# Altium schematic sheet STM32.SchDoc
size A
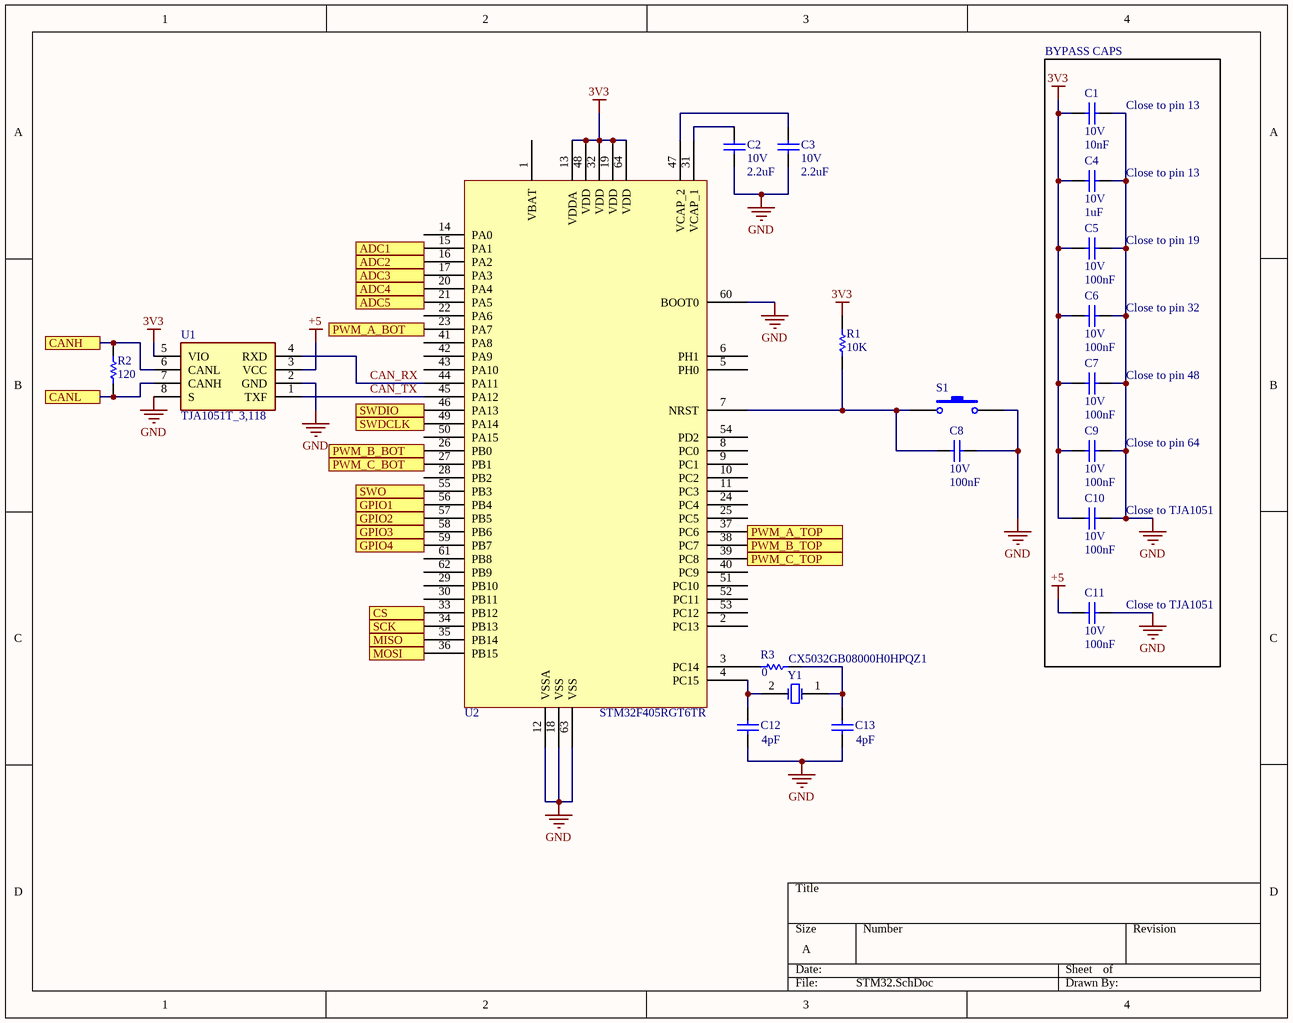
[diagram p0: STM32.SchDoc]

## Parts
C1  10V  value 10nF  [C0805]
C2  10V  value 2.2uF  [C0805]
C3  10V  value 2.2uF  [C0805]
C4  10V  value 1uF  [C0805]
C5  10V  value 100nF  [C0805]
C6  10V  value 100nF  [C0805]
C7  10V  value 100nF  [C0805]
C8  10V  value 100nF  [C0805]
C9  10V  value 100nF  [C0805]
C10  10V  value 100nF  [C0805]
C11  10V  value 100nF  [C0805]
C12  value 4pF  [C0805]  (hidden comment: 50V)
C13  value 4pF  [C0805]  (hidden comment: 50V)
R1  value 10K  [J1-0603]  (hidden comment: 5%)
R2  value 120  [J1-0603]  (hidden comment: 5%)
R3  value 0  [J1-0603]  (hidden comment: 0603)
S1  SW-PB  [PTS636 SM43 SMTR LFS]  (value not drawn)
U1  TJA1051T_3,118  [SOIC127P600X175-8N]
U2  STM32F405RGT6TR  [STM32F405RGT6TR]
Y1  CX5032GB08000H0HPQZ1  [CX5032GB08000H0HPQZ1]

## Ports
ADC1, ADC2, ADC3, ADC4, ADC5, CANH, CANL, CS, GPIO1, GPIO2, GPIO3, GPIO4, MISO, MOSI, PWM_A_BOT, PWM_A_TOP, PWM_B_BOT, PWM_B_TOP, PWM_C_BOT, PWM_C_TOP, SCK, SWDCLK, SWDIO, SWO

## Nets
3V3: C1.1 C4.2 C5.1 C6.1 C7.1 C9.1 C10.1 R1.2 U1.5(VIO) U2.13(VDDA) U2.19(VDD) U2.32(VDD) U2.48(VDD) U2.64(VDD)
+5: C11.1 U1.3(VCC)
GND: C1.2 C2.1 C3.1 C4.1 C5.2 C6.2 C7.2 C8.2 C9.2 C10.2 C11.2 C12.1 C13.1 S1.2 U1.2(GND) U1.8(S) U2.12(VSSA) U2.18(VSS) U2.60(BOOT0) U2.63(VSS)
ADC1: U2.15(PA1) ; port ADC1
ADC2: U2.16(PA2) ; port ADC2
ADC3: U2.17(PA3) ; port ADC3
ADC4: U2.20(PA4) ; port ADC4
ADC5: U2.21(PA5) ; port ADC5
CAN_RX: U1.4(RXD) U2.44(PA11)
CAN_TX: U1.1(TXF) U2.45(PA12)
CANH: R2.2 U1.6(CANL) ; port CANH
CANL: R2.1 U1.7(CANH) ; port CANL
CS: U2.33(PB12) ; port CS
GPIO1: U2.56(PB4) ; port GPIO1
GPIO2: U2.57(PB5) ; port GPIO2
GPIO3: U2.58(PB6) ; port GPIO3
GPIO4: U2.59(PB7) ; port GPIO4
MISO: U2.35(PB14) ; port MISO
MOSI: U2.36(PB15) ; port MOSI
PWM_A_BOT: U2.23(PA7) ; port PWM_A_BOT
PWM_A_TOP: U2.37(PC6) ; port PWM_A_TOP
PWM_B_BOT: U2.26(PB0) ; port PWM_B_BOT
PWM_B_TOP: U2.38(PC7) ; port PWM_B_TOP
PWM_C_BOT: U2.27(PB1) ; port PWM_C_BOT
PWM_C_TOP: U2.39(PC8) ; port PWM_C_TOP
SCK: U2.34(PB13) ; port SCK
SWDCLK: U2.49(PA14) ; port SWDCLK
SWDIO: U2.46(PA13) ; port SWDIO
SWO: U2.55(PB3) ; port SWO
NetC2_2: C2.2 U2.31(VCAP_1)
NetC3_2: C3.2 U2.47(VCAP_2)
NetC8_1: C8.1 R1.1 S1.1 U2.7(NRST)
NetC12_2: C12.2 U2.4(PC15) Y1.2(OSC2)
NetC13_2: C13.2 R3.2 Y1.1(OSC1)
NetR3_1: R3.1 U2.3(PC14)

Not connected (* = marked no-connect by the designer): U2 1(VBAT) 2(PC13) 5(PH0) 6(PH1) 8(PC0) 9(PC1) 10(PC2) 11(PC3) 14(PA0) 22(PA6) 24(PC4) 25(PC5) 28(PB2) 29(PB10) 30(PB11) 40(PC9) 41(PA8) 42(PA9) 43(PA10) 50(PA15) 51(PC10) 52(PC11) 53(PC12) 54(PD2) 61(PB8) 62(PB9)

## Notes on the sheet
- BYPASS CAPS
- (near C1) Close to pin 13
- (near C4) Close to pin 13
- (near C5) Close to pin 19
- (near C6) Close to pin 32
- (near C7) Close to pin 48
- (near C9) Close to pin 64
- (near C10) Close to TJA1051
- (near C11) Close to TJA1051

## Library data of the parts
C1 = Cap: C0805C103K8RAC7800. 10000pF ±10% 10V Ceramic Capacitor X7R 0805 (2012 Metric) /; Published: 8-Jun-2000; LatestRevisionDate: 17-Jul-2002; LatestRevisionNote: Re-released for DXP Platform.; PackageReference: RAD-0.3; Publisher: Altium Limited; PackageDescription: Radial Cap, Thru-Hole; 2 Leads; 0.3 in Pin Spacing
C2 C3 = Cap: C0805C225K8RACAUTO. 2.2µF ±10% 10V Ceramic Capacitor X7R 0805 (2012 Metric) /; Published: 8-Jun-2000; LatestRevisionDate: 17-Jul-2002; LatestRevisionNote: Re-released for DXP Platform.; PackageReference: RAD-0.3; Publisher: Altium Limited; PackageDescription: Radial Cap, Thru-Hole; 2 Leads; 0.3 in Pin Spacing
C4 = Cap: CL21B105KPFNNNE. 1µF ±10% 10V Ceramic Capacitor X7R 0805 (2012 Metric) /; Published: 8-Jun-2000; LatestRevisionDate: 17-Jul-2002; LatestRevisionNote: Re-released for DXP Platform.; PackageReference: RAD-0.3; Publisher: Altium Limited; PackageDescription: Radial Cap, Thru-Hole; 2 Leads; 0.3 in Pin Spacing
C5-C11 = Cap: C0805C104K8RACTU. 0.1µF ±10% 10V Ceramic Capacitor X7R 0805 (2012 Metric) /; Published: 8-Jun-2000; LatestRevisionDate: 17-Jul-2002; LatestRevisionNote: Re-released for DXP Platform.; PackageReference: RAD-0.3; Publisher: Altium Limited; PackageDescription: Radial Cap, Thru-Hole; 2 Leads; 0.3 in Pin Spacing
C12 = Cap: CBR08C409B5GAC. 4pF ±0.1pF 50V Ceramic Capacitor C0G, NP0 0805 (2012 Metric); Published: 8-Jun-2000; LatestRevisionDate: 17-Jul-2002; LatestRevisionNote: Re-released for DXP Platform.; PackageReference: RAD-0.3; Publisher: Altium Limited; PackageDescription: Radial Cap, Thru-Hole; 2 Leads; 0.3 in Pin Spacing
C13 = Cap: CBR08C409B5GAC; Published: 8-Jun-2000; LatestRevisionDate: 17-Jul-2002; LatestRevisionNote: Re-released for DXP Platform.; PackageReference: RAD-0.3; Publisher: Altium Limited; PackageDescription: Radial Cap, Thru-Hole; 2 Leads; 0.3 in Pin Spacing
R1 R2 = Res1: ERJ-3GEYJ103V. 10 kOhms ±5% 0.1W, 1/10W Chip Resistor 0603 (1608 Metric) Automotive AEC-Q200 Thick Film /; Published: 8-Jun-2000; LatestRevisionDate: 17-Jul-2002; LatestRevisionNote: Re-released for DXP Platform.; PackageReference: AXIAL-0.3; Publisher: Altium Limited; PackageDescription: Axial Device, Thru-Hole; 2 Leads; 0.3 in Pin Spacing
R3 = Res1: ERJ-U030R00V. 0 Ohms Jumper 0.1W, 1/10W Chip Resistor 0603 (1608 Metric) Anti-Sulfur, Automotive AEC-Q200 Thick Film; Published: 8-Jun-2000; LatestRevisionDate: 17-Jul-2002; LatestRevisionNote: Re-released for DXP Platform.; PackageReference: AXIAL-0.3; Publisher: Altium Limited; PackageDescription: Axial Device, Thru-Hole; 2 Leads; 0.3 in Pin Spacing
S1 = SW-PB: Switch; Published: 24-Mar-1999; LatestRevisionDate: 17-Jul-2002; LatestRevisionNote: Re-released for DXP Platform.; PackageReference: SPST-2; Publisher: Altium Limited; PackageDescription: Switch; 2 Leads
U1 = TJA1051T_3,118: Integrated Circuit; Manufacturer_Name: NXP; Manufacturer_Part_Number: TJA1051T/3,118; Datasheet Link: http://www.nxp.com/docs/en/data-sheet/TJA1051.pdf; Height: 1.75mm; Arrow Part Number: TJA1051T/3,118; Arrow Price/Stock: https://www.arrow.com/en/products/tja1051t3118/nxp-semiconductors; Mouser Part Number: 771-TJA1051T3118; Mouser Price/Stock: https://www.mouser.co.uk/ProductDetail/NXP-Semiconductors/TJA1051T-3118?qs=O%2F7ihdSJpebv1PFlp05wnQ%3D%3D
Y1 = XTAL: 8MHz ±20ppm Crystal 12pF 300 Ohms 2-SMD, No Lead /; Published: 8-Jun-2000; LatestRevisionDate: 17-Jul-2002; LatestRevisionNote: Re-released for DXP Platform.; PackageReference: R38; Publisher: Altium Limited; PackageDescription: Crystal, Thru-Hole; 2 Leads; Body 3.1 x 8.2 mm (Dia.xH)